# EAGLE design rk86fdd (EAGLE 6.4)

## Sheet 1 of 2
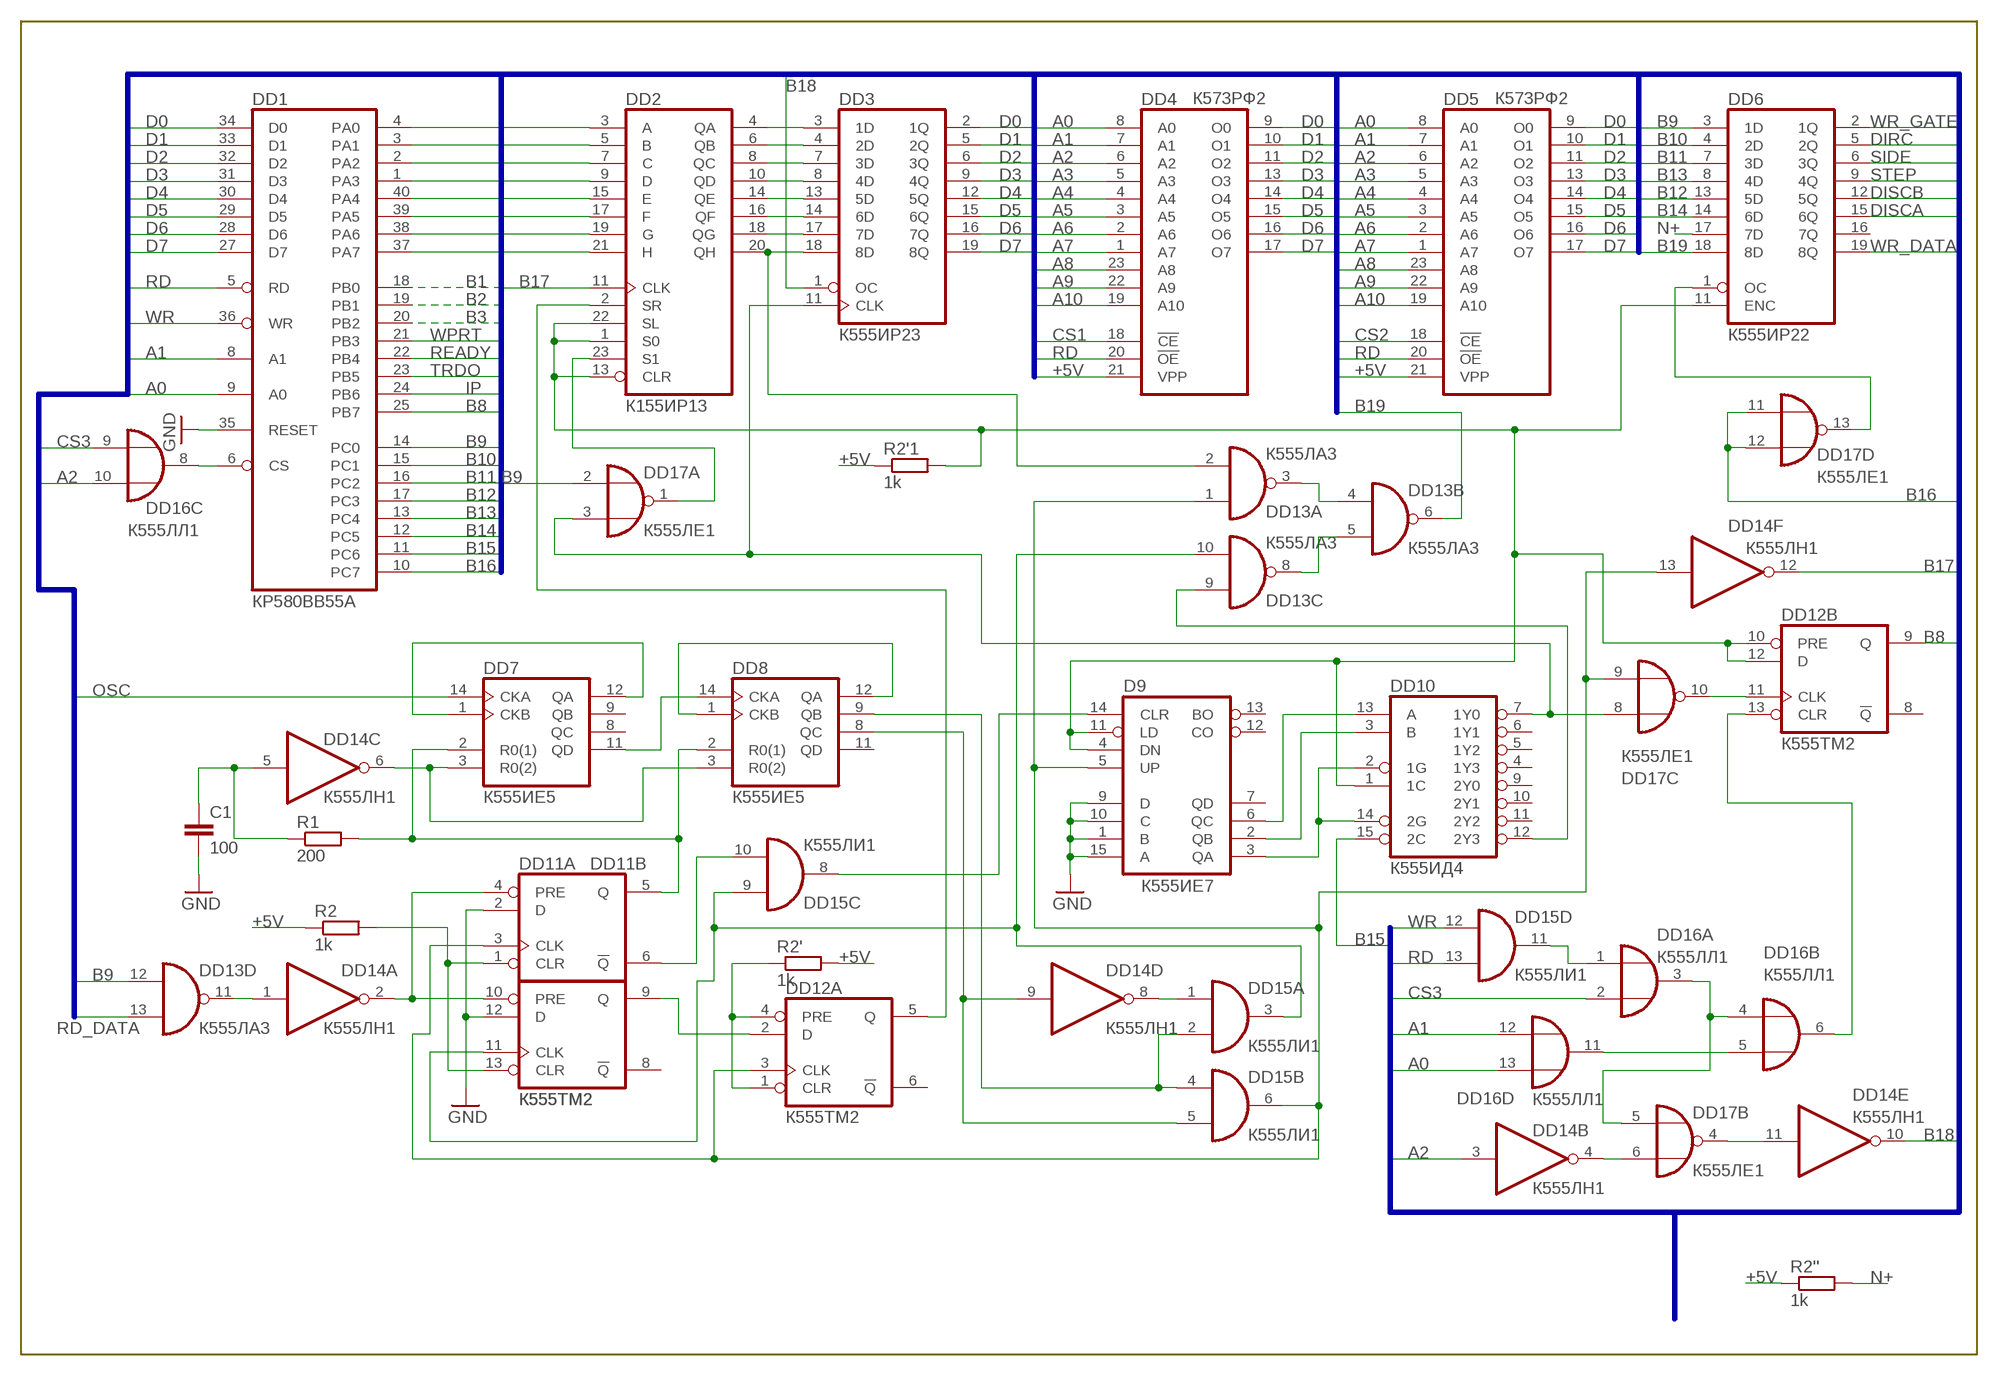
[diagram p0: schematic, sheet 1]

### Parts
C1  100  C-EU050-025X075  [C050-025X075]
D9  К555ИЕ7  74LS192N  [DIL16]
DD1  КР580ВВ55А  8255A  [DIL40]
DD2  К155ИР13  74198N  [DIL24-6]
DD3  К555ИР23  74LS374N  [DIL20]
DD4  К573РФ2  2716  [DIL24]
DD5  К573РФ2  2716  [DIL24]
DD6  К555ИР22  74LS373N  [DIL20]
DD7  К555ИЕ5  74HC93N  [DIL14]
DD8  К555ИЕ5  74HC93N  [DIL14]
DD10  К555ИД4  74LS155N  [DIL16]
DD11  К555ТМ2  74LS74N  [DIL14]
DD12  К555ТМ2  74LS74N  [DIL14]
DD13  К555ЛА3  74LS00N  [DIL14]
DD14  К555ЛН1  74LS04N  [DIL14]
DD15  К555ЛИ1  74LS08N  [DIL14]
DD16  К555ЛЛ1  74LS32N  [DIL14]
DD17  К555ЛЕ1  74LS02N  [DIL14]
R1  200  R-EU_R0805  [R0805]
R2  1k  R-EU_R0805  [R0805]
R2'  1k  R-EU_R0805  [R0805]
R2'1  1k  R-EU_R0805  [R0805]
R2''  1k  R-EU_R0805  [R0805]

### Nets
1LOG: D9.4(DN) D9.11(LD) DD2.1(S0) DD2.13(CLR) DD2.22(SL) DD6.11(ENC) DD10.1(1C) DD12.10(B:PRE) DD12.12(B:D) R2'1.2
+5V: DD4.21(VPP) DD5.21(VPP) R2'1.1 R2''.1 R2'.2 R2.1 ; also sheet 2
A0: DD1.9(A0) DD4.8(A0) DD5.8(A0) DD16.13(D:I1) ; also sheet 2
A1: DD1.8(A1) DD4.7(A1) DD5.7(A1) DD16.12(D:I0) ; also sheet 2
A2: DD4.6(A2) DD5.6(A2) DD14.3(B:I) DD16.10(C:I1) ; also sheet 2
A3: DD4.5(A3) DD5.5(A3) ; also sheet 2
A4: DD4.4(A4) DD5.4(A4) ; also sheet 2
A5: DD4.3(A5) DD5.3(A5) ; also sheet 2
A6: DD4.2(A6) DD5.2(A6) ; also sheet 2
A7: DD4.1(A7) DD5.1(A7) ; also sheet 2
A8: DD4.23(A8) DD5.23(A8) ; also sheet 2
A9: DD4.22(A9) DD5.22(A9) ; also sheet 2
A10: DD4.19(A10) DD5.19(A10) ; also sheet 2
B1: DD1.18(PB0)
B2: DD1.19(PB1)
B3: DD1.20(PB2)
B8: DD1.25(PB7) DD12.9(B:Q)
B9: DD1.14(PC0) DD6.3(1D) DD13.12(D:I0) DD17.2(A:I0)
B10: DD1.15(PC1) DD6.4(2D)
B11: DD1.16(PC2) DD6.7(3D)
B12: DD1.17(PC3) DD6.13(5D)
B13: DD1.13(PC4) DD6.8(4D)
B14: DD1.12(PC5) DD6.14(6D)
B15: DD1.11(PC6) DD10.15(2C)
B16: DD1.10(PC7) DD17.11(D:I0) DD17.12(D:I1)
B17: DD2.11(CLK) DD14.12(F:O)
B18: DD3.1(OC) DD14.10(E:O)
B19: DD6.18(8D) DD13.6(B:O)
CS1: DD4.18(!CE) ; also sheet 2
CS2: DD5.18(!CE) ; also sheet 2
CS3: DD16.2(A:I1) DD16.9(C:I0) ; also sheet 2
D0: DD1.34(D0) DD3.2(1Q) DD4.9(O0) DD5.9(O0) ; also sheet 2
D1: DD1.33(D1) DD3.5(2Q) DD4.10(O1) DD5.10(O1) ; also sheet 2
D2: DD1.32(D2) DD3.6(3Q) DD4.11(O2) DD5.11(O2) ; also sheet 2
D3: DD1.31(D3) DD3.9(4Q) DD4.13(O3) DD5.13(O3) ; also sheet 2
D4: DD1.30(D4) DD3.12(5Q) DD4.14(O4) DD5.14(O4) ; also sheet 2
D5: DD1.29(D5) DD3.15(6Q) DD4.15(O5) DD5.15(O5) ; also sheet 2
D6: DD1.28(D6) DD3.16(7Q) DD4.16(O6) DD5.16(O6) ; also sheet 2
D7: DD1.27(D7) DD3.19(8Q) DD4.17(O7) DD5.17(O7) ; also sheet 2
DD12Q5: DD2.2(SR) DD12.5(A:Q)
DIRC: DD6.5(2Q) ; also sheet 2
DISCA: DD6.15(6Q) ; also sheet 2
DISCB: DD6.12(5Q) ; also sheet 2
GND: C1.2 D9.1(B) D9.9(D) D9.10(C) D9.15(A) DD1.35(RESET) DD11.2(A:D) DD11.12(B:D) ; also sheet 2
IP: DD1.24(PB6) ; also sheet 2
LOG1: DD12.1(A:CLR) DD12.4(A:PRE) R2'.1
N$1: DD13.11(D:O) DD14.1(A:I)
N$2: DD2.4(QA) DD3.3(1D)
N$3: DD2.6(QB) DD3.4(2D)
N$4: DD2.8(QC) DD3.7(3D)
N$5: DD2.10(QD) DD3.8(4D)
N$6: DD2.14(QE) DD3.13(5D)
N$7: DD2.16(QF) DD3.14(6D)
N$8: DD2.18(QG) DD3.17(7D)
N$9: DD2.20(QH) DD3.18(8D) DD13.2(A:I1)
N$10: DD7.1(CKB) DD7.12(QA)
N$11: DD8.1(CKB) DD8.12(QA)
N$12: DD1.4(PA0) DD2.3(A)
N$13: DD1.3(PA1) DD2.5(B)
N$14: DD1.2(PA2) DD2.7(C)
N$15: DD1.1(PA3) DD2.9(D)
N$16: DD7.11(QD) DD8.14(CKA)
N$17: DD7.3(R0(2)) DD8.3(R0(2)) DD14.6(C:O)
N$18: DD1.40(PA4) DD2.15(E)
N$19: DD1.39(PA5) DD2.17(F)
N$20: DD1.38(PA6) DD2.19(G)
N$21: DD1.37(PA7) DD2.21(H)
N$22: DD7.2(R0(1)) DD8.2(R0(1)) DD11.5(A:Q) R1.2
N$23: D9.5(UP) DD11.3(A:CLK) DD12.3(A:CLK) DD13.1(A:I0) DD14.13(F:I) DD15.6(B:O) DD17.9(C:I1)
N$24: DD11.1(A:CLR) DD11.13(B:CLR) R2.2
N$25: DD11.9(B:Q) DD12.2(A:D)
N$26: DD15.11(D:O) DD16.1(A:I0)
N$27: DD6.1(OC) DD17.13(D:O)
N$28: C1.1 DD14.5(C:I) R1.1
N$29: DD2.23(S1) DD17.1(A:O)
N$30: DD3.11(CLK) DD10.7(1Y0) DD17.3(A:I1) DD17.8(C:I0)
N$31: DD11.4(A:PRE) DD11.10(B:PRE) DD14.2(A:O)
N$32: DD16.3(A:O) DD16.4(B:I0) DD17.5(B:I0)
N$33: DD1.6(CS) DD16.8(C:O)
N$34: D9.3(QA) DD10.2(1G) DD10.14(2G)
N$35: DD11.6(A:!Q) DD15.10(C:I1)
N$36: DD11.11(B:CLK) DD13.10(C:I1) DD15.3(A:O) DD15.9(C:I0)
N$37: DD12.11(B:CLK) DD17.10(C:O)
N$38: DD16.5(B:I1) DD16.11(D:O)
N$39: DD14.4(B:O) DD17.6(B:I1)
N$40: DD12.13(B:CLR) DD16.6(B:O)
N$41: DD14.11(E:I) DD17.4(B:O)
N$42: DD8.9(QB) DD15.2(A:I1) DD15.4(B:I0)
N$43: DD14.8(D:O) DD15.1(A:I0)
N$44: DD8.8(QC) DD14.9(D:I) DD15.5(B:I1)
N$45: DD13.3(A:O) DD13.4(B:I0)
N$46: DD13.5(B:I1) DD13.8(C:O)
N$48: D9.14(CLR) DD15.8(C:O)
N$49: D9.2(QB) DD10.3(B)
N$50: D9.6(QC) DD10.13(A)
N$51: DD10.12(2Y3) DD13.9(C:I0)
N+: DD6.17(7D) R2''.2
OSC: DD7.14(CKA) ; also sheet 2
RD: DD1.5(RD) DD4.20(!OE) DD5.20(!OE) DD15.13(D:I1) ; also sheet 2
RD_DATA: DD13.13(D:I1) ; also sheet 2
READY: DD1.22(PB4) ; also sheet 2
SIDE: DD6.6(3Q) ; also sheet 2
STEP: DD6.9(4Q) ; also sheet 2
TRDO: DD1.23(PB5) ; also sheet 2
WPRT: DD1.21(PB3) ; also sheet 2
WR: DD1.36(WR) DD15.12(D:I0) ; also sheet 2
WR_DATA: DD6.19(8Q) ; also sheet 2
WR_GATE: DD6.2(1Q) ; also sheet 2
Unconnected: D9.7(QD) D9.12(CO) D9.13(BO) DD6.16(7Q) DD7.8(QC) DD7.9(QB) DD8.11(QD) DD10.4(1Y3) DD10.5(1Y2) DD10.6(1Y1) DD10.9(2Y0) DD10.10(2Y1) DD10.11(2Y2) DD11.8(B:!Q) DD12.6(A:!Q) DD12.8(B:!Q)

### Buses
A[0..10],D[0..7],CS[1..3],WPRT,READY,TRDO,B[1..3],B[8..19],DD12Q5,+5V,WR_GATE,DIRC,SIDE,STEP,DISCB,DISCA,WR_DATA,IP,RD,WR,ER,OSC,RD_DATA

## Sheet 2 of 2
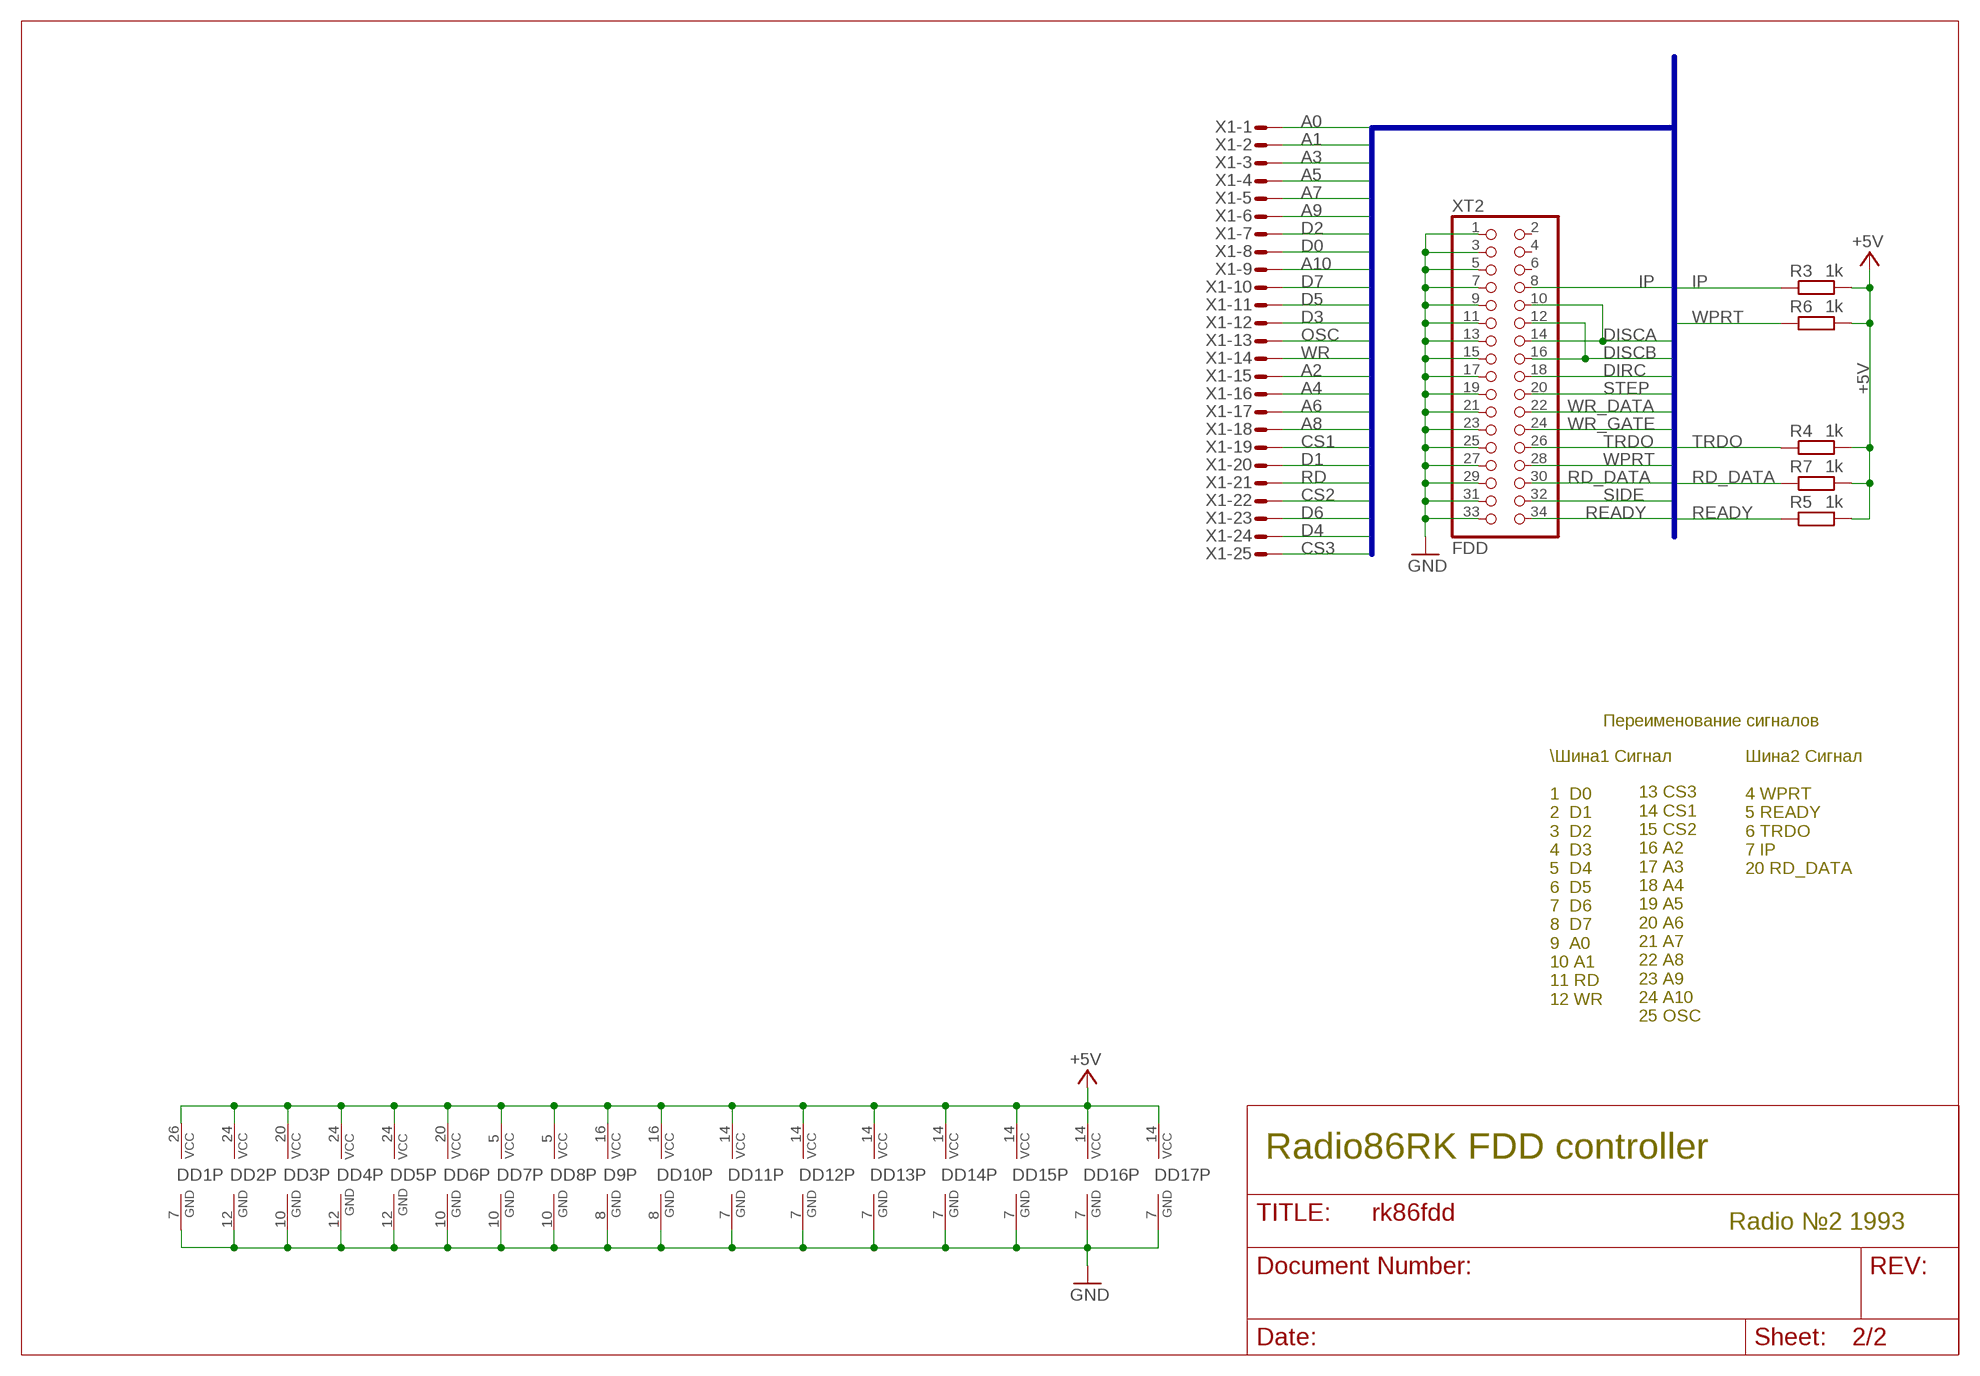
[diagram p1: schematic, sheet 2]

### Parts
R3  1k  R-EU_R0805  [R0805]
R4  1k  R-EU_R0805  [R0805]
R5  1k  R-EU_R0805  [R0805]
R6  1k  R-EU_R0805  [R0805]
R7  1k  R-EU_R0805  [R0805]
X1  M25HPS  [M25HP]
XT2  FDD  PINHD-2X17  [2X17]

### Nets
+5V: D9.16(VCC) DD1.26(VCC) DD2.24(VCC) DD3.20(VCC) DD4.24(VCC) DD5.24(VCC) DD6.20(VCC) DD7.5(VCC) DD8.5(VCC) DD10.16(VCC) DD11.14(P:VCC) DD12.14(P:VCC) DD13.14(P:VCC) DD14.14(P:VCC) DD15.14(P:VCC) DD16.14(P:VCC) DD17.14(P:VCC) R3.2 R4.2 R5.2 R6.2 R7.2 ; also sheet 1
A0: X1.1 ; also sheet 1
A1: X1.2 ; also sheet 1
A2: X1.15 ; also sheet 1
A3: X1.3 ; also sheet 1
A4: X1.16 ; also sheet 1
A5: X1.4 ; also sheet 1
A6: X1.17 ; also sheet 1
A7: X1.5 ; also sheet 1
A8: X1.18 ; also sheet 1
A9: X1.6 ; also sheet 1
A10: X1.9 ; also sheet 1
CS1: X1.19 ; also sheet 1
CS2: X1.22 ; also sheet 1
CS3: X1.25 ; also sheet 1
D0: X1.8 ; also sheet 1
D1: X1.20 ; also sheet 1
D2: X1.7 ; also sheet 1
D3: X1.12 ; also sheet 1
D4: X1.24 ; also sheet 1
D5: X1.11 ; also sheet 1
D6: X1.23 ; also sheet 1
D7: X1.10 ; also sheet 1
DIRC: XT2.18 ; also sheet 1
DISCA: XT2.10 XT2.14 ; also sheet 1
DISCB: XT2.12 XT2.16 ; also sheet 1
GND: D9.8(GND) DD1.7(GND) DD2.12(GND) DD3.10(GND) DD4.12(GND) DD5.12(GND) DD6.10(GND) DD7.10(GND) DD8.10(GND) DD10.8(GND) DD11.7(P:GND) DD12.7(P:GND) DD13.7(P:GND) DD14.7(P:GND) DD15.7(P:GND) DD16.7(P:GND) DD17.7(P:GND) XT2.1 XT2.3 XT2.5 XT2.7 XT2.9 XT2.11 XT2.13 XT2.15 XT2.17 XT2.19 XT2.21 XT2.23 XT2.25 XT2.27 XT2.29 XT2.31 XT2.33 ; also sheet 1
IP: R3.1 XT2.8 ; also sheet 1
OSC: X1.13 ; also sheet 1
RD: X1.21 ; also sheet 1
RD_DATA: R7.1 XT2.30 ; also sheet 1
READY: R5.1 XT2.34 ; also sheet 1
SIDE: XT2.32 ; also sheet 1
STEP: XT2.20 ; also sheet 1
TRDO: R4.1 XT2.26 ; also sheet 1
WPRT: R6.1 XT2.28 ; also sheet 1
WR: X1.14 ; also sheet 1
WR_DATA: XT2.22 ; also sheet 1
WR_GATE: XT2.24 ; also sheet 1
Unconnected: XT2.2 XT2.4 XT2.6

### Buses
A[0..10],D[0..7],CS[1..3],WPRT,READY,TRDO,B[1..3],B[8..19],DD12Q5,+5V,WR_GATE,DIRC,SIDE,STEP,DISCB,DISCA,WR_DATA,IP,RD,WR,ER,OSC,RD_DATA

### Notes on the sheet
- Переименование сигналов
- \Шина1 Сигнал
  
  1  D0
  2  D1
  3  D2
  4  D3
  5  D4
  6  D5
  7  D6
  8  D7
  9  A0
  10 A1
  11 RD
  12 WR
- Шина2 Сигнал
  
  4 WPRT
  5 READY
  6 TRDO
  7 IP
  20 RD_DATA
- 13 CS3
  14 CS1
  15 CS2
  16 A2
  17 A3
  18 A4
  19 A5
  20 A6
  21 A7
  22 A8
  23 A9
  24 A10
  25 OSC
- Radio86RK FDD controller
- Radio №2 1993

## Library data of the parts
C1 = rcl:C-EU: CAPACITOR, European symbol
D9 = 74xx-eu:74*192: Synchronous 4-bit UP/DOWN COUNTER
DD1 = micro-intel:8255A: MICROCOMPUTER/PERIPHERAL DEVICE; OC_FARNELL: unknown; OC_NEWARK: unknown
DD2 = 74xx-eu:74*198: 8-bit SHIFT REGISTER
DD3 = 74xx-eu:74*374: Octal D type transparent LATCH, edge triggered
DD4 DD5 = memory:2716: MEMORY
DD6 = 74xx-eu:74*373: Octal D type transparent LATCH, edge triggered
DD7 DD8 = 74xx-eu:74*93: Decade, divide by twelve and binary COUNTER
DD10 = 74xx-eu:74*155: Dual 2-line to 4-line data DECODER/DEMULTIPLEXER
DD11 DD12 = 74xx-eu:74*74: Dual D type positive edge triggered FLIP FLOP, preset and clear
DD13 = 74xx-eu:74*00: Quad 2-input NAND gate
DD14 = 74xx-eu:74*04: Hex INVERTER
DD15 = 74xx-eu:74*08: Quad 2-input AND gate
DD16 = 74xx-eu:74*32: Quad 2-input OR gate
DD17 = 74xx-eu:74*02: Quad 2-input NOR gate
R1 R2 R2' R2'1 R2'' R3-R7 = rcl:R-EU_: RESISTOR, European symbol
X1 = con-subd:M25?S: SUB-D; OC_FARNELL: unknown; OC_NEWARK: unknown
XT2 = Разъёмы штырьковые 2.54мм:PINHD-2X17: PIN HEADER

## Board
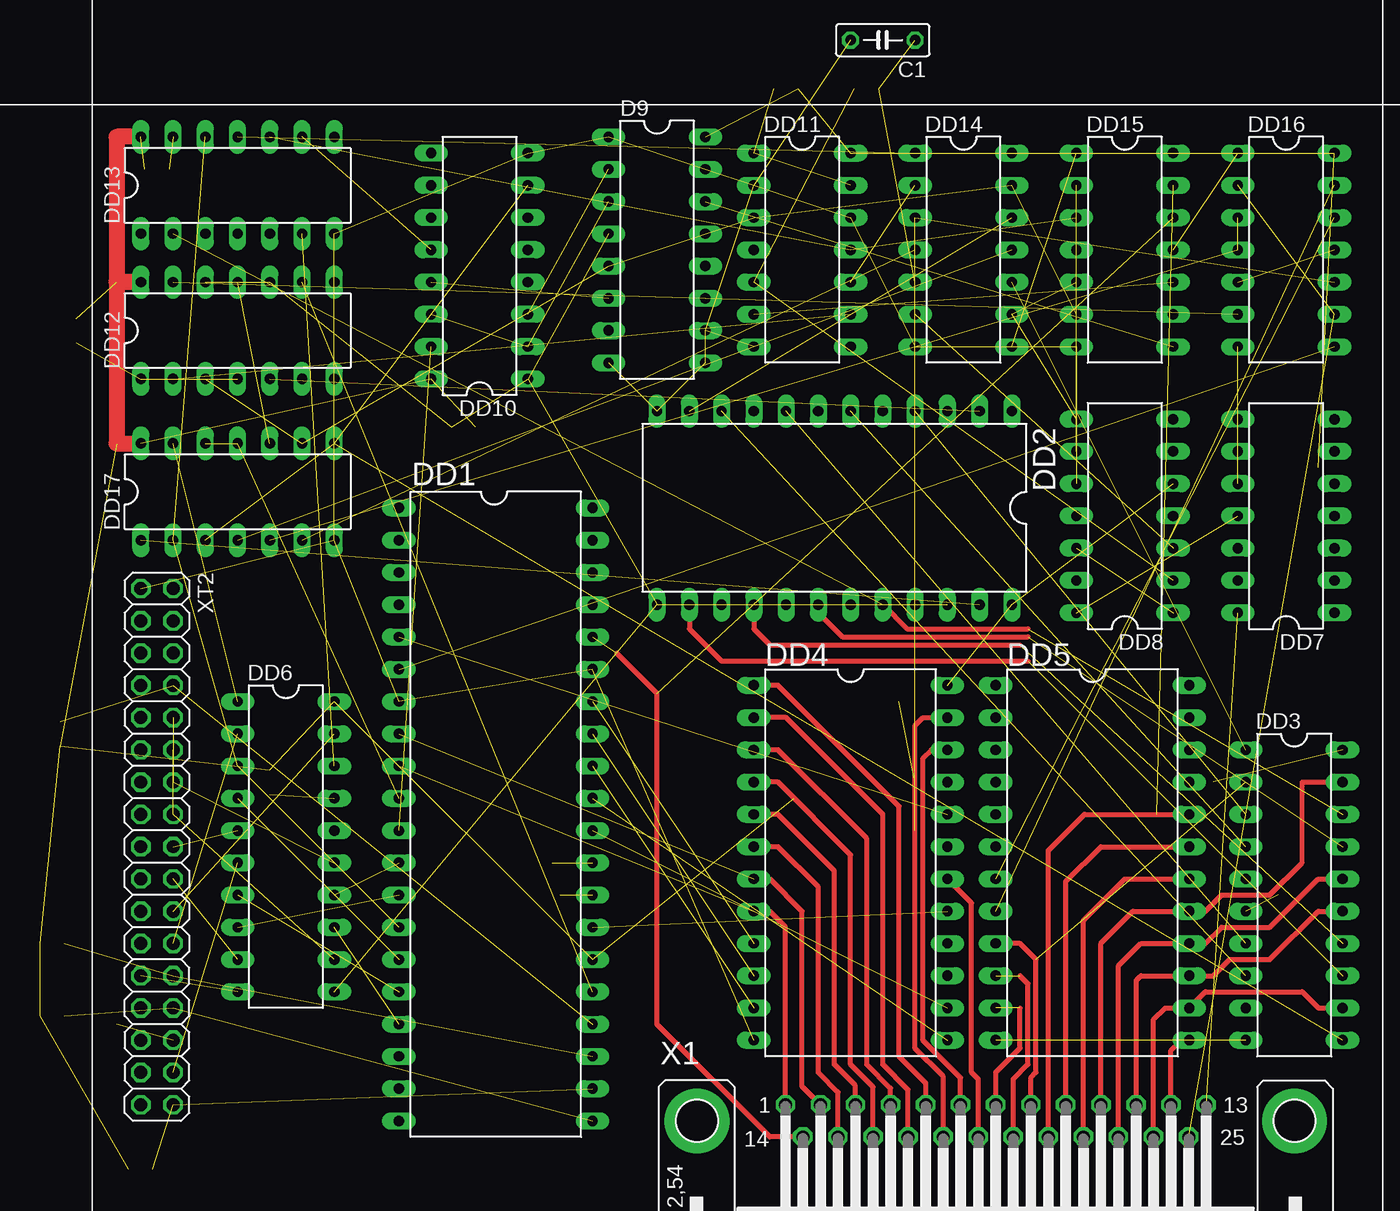
[diagram p2: board, top side]
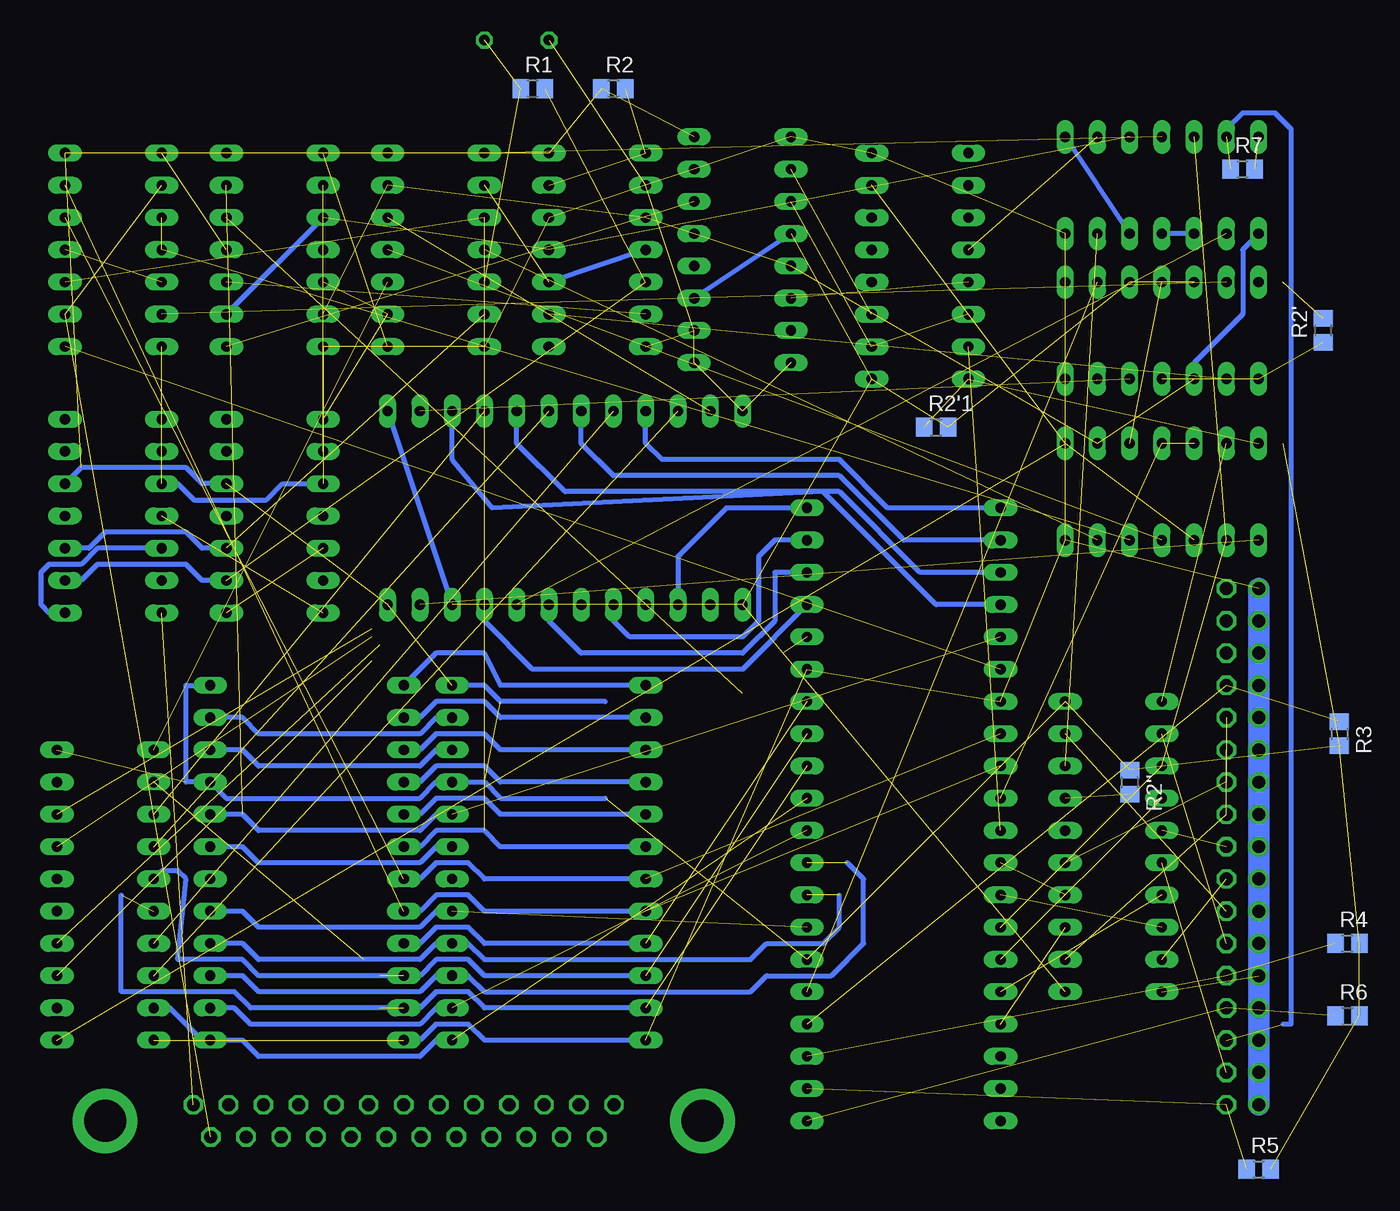
[diagram p3: board, bottom side, seen from below]

No outline drawn. Coordinates in mm, seen from the top.
Copper layers (1*16): Top 0.035mm / dielectric 1.5mm / Bottom 0.035mm
Design rules "default": minimum track width 10mil, minimum drill 24mil, track to track 8mil, track to pad 8mil, pad to pad 8mil, via to via 8mil, smd to smd 8mil, copper to edge 40mil, drill to drill 8mil, minimum pad ring 10mil, minimum via ring 8mil, stop-mask expansion 4mil, vias tented up to drill 0mil, thermal gap 10mil

### Footprints (pad centres in the part's own frame; a part is rotated, then mirrored left to right if it is on the bottom)
C050-025X075 = drill 0.813 octagon: 1 -2.54,0; 2 2.54,0
DIL16 = drill 0.813 long: 1 -8.89,-3.81; 2 -6.35,-3.81; 3 -3.81,-3.81; 4 -1.27,-3.81; 5 1.27,-3.81; 6 3.81,-3.81; 7 6.35,-3.81; 8 8.89,-3.81; 9 8.89,3.81; 10 6.35,3.81; 11 3.81,3.81; 12 1.27,3.81; 13 -1.27,3.81; 14 -3.81,3.81; 15 -6.35,3.81; 16 -8.89,3.81
DIL40 = drill 0.813 long: 1 -24.13,-7.62; 2 -21.59,-7.62; 3 -19.05,-7.62; 4 -16.51,-7.62; 5 -13.97,-7.62; 6 -11.43,-7.62; 7 -8.89,-7.62; 8 -6.35,-7.62; 9 -3.81,-7.62; 10 -1.27,-7.62; 11 1.27,-7.62; 12 3.81,-7.62; 13 6.35,-7.62; 14 8.89,-7.62; 15 11.43,-7.62; 16 13.97,-7.62; 17 16.51,-7.62; 18 19.05,-7.62; 19 21.59,-7.62; 20 24.13,-7.62; 21 24.13,7.62; 22 21.59,7.62; 23 19.05,7.62; 24 16.51,7.62; 25 13.97,7.62; 26 11.43,7.62; 27 8.89,7.62; 28 6.35,7.62; 29 3.81,7.62; 30 1.27,7.62; 31 -1.27,7.62; 32 -3.81,7.62; 33 -6.35,7.62; 34 -8.89,7.62; 35 -11.43,7.62; 36 -13.97,7.62; 37 -16.51,7.62; 38 -19.05,7.62; 39 -21.59,7.62; 40 -24.13,7.62
DIL24-6 = drill 0.813 long: 1 -13.97,-7.62; 2 -11.43,-7.62; 3 -8.89,-7.62; 4 -6.35,-7.62; 5 -3.81,-7.62; 6 -1.27,-7.62; 7 1.27,-7.62; 8 3.81,-7.62; 9 6.35,-7.62; 10 8.89,-7.62; 11 11.43,-7.62; 12 13.97,-7.62; 13 13.97,7.62; 14 11.43,7.62; 15 8.89,7.62; 16 6.35,7.62; 17 3.81,7.62; 18 1.27,7.62; 19 -1.27,7.62; 20 -3.81,7.62; 21 -6.35,7.62; 22 -8.89,7.62; 23 -11.43,7.62; 24 -13.97,7.62
DIL20 = drill 0.813 long: 1 -11.43,-3.81; 2 -8.89,-3.81; 3 -6.35,-3.81; 4 -3.81,-3.81; 5 -1.27,-3.81; 6 1.27,-3.81; 7 3.81,-3.81; 8 6.35,-3.81; 9 8.89,-3.81; 10 11.43,-3.81; 11 11.43,3.81; 12 8.89,3.81; 13 6.35,3.81; 14 3.81,3.81; 15 1.27,3.81; 16 -1.27,3.81; 17 -3.81,3.81; 18 -6.35,3.81; 19 -8.89,3.81; 20 -11.43,3.81
DIL24 = drill 0.813 long: 1 -13.97,-7.62; 2 -11.43,-7.62; 3 -8.89,-7.62; 4 -6.35,-7.62; 5 -3.81,-7.62; 6 -1.27,-7.62; 7 1.27,-7.62; 8 3.81,-7.62; 9 6.35,-7.62; 10 8.89,-7.62; 11 11.43,-7.62; 12 13.97,-7.62; 13 13.97,7.62; 14 11.43,7.62; 15 8.89,7.62; 16 6.35,7.62; 17 3.81,7.62; 18 1.27,7.62; 19 -1.27,7.62; 20 -3.81,7.62; 21 -6.35,7.62; 22 -8.89,7.62; 23 -11.43,7.62; 24 -13.97,7.62
DIL14 = drill 0.813 long: 1 -7.62,-3.81; 2 -5.08,-3.81; 3 -2.54,-3.81; 4 0,-3.81; 5 2.54,-3.81; 6 5.08,-3.81; 7 7.62,-3.81; 8 7.62,3.81; 9 5.08,3.81; 10 2.54,3.81; 11 0,3.81; 12 -2.54,3.81; 13 -5.08,3.81; 14 -7.62,3.81
R0805 = smd 1.3 x 1.5: 1 -0.95,0; 2 0.95,0
M25HP = drill 1.016 octagon: 1 -16.561,1.27; 2 -13.792,1.27; 3 -11.049,1.27; 4 -8.28,1.27; 5 -5.512,1.27; 6 -2.769,1.27; 7 0,1.27; 8 2.769,1.27; 9 5.512,1.27; 10 8.28,1.27; 11 11.049,1.27; 12 13.792,1.27; 13 16.561,1.27; 14 -15.189,-1.27; 15 -12.421,-1.27; 16 -9.652,-1.27; 17 -6.909,-1.27; 18 -4.14,-1.27; 19 -1.372,-1.27; 20 1.372,-1.27; 21 4.14,-1.27; 22 6.909,-1.27; 23 9.652,-1.27; 24 12.421,-1.27; 25 15.189,-1.27 | drill 3.302 pad 5.08: G1 -23.52,0; G2 23.52,0
2X17 = drill 1.016 octagon: 1 -20.32,-1.27; 2 -20.32,1.27; 3 -17.78,-1.27; 4 -17.78,1.27; 5 -15.24,-1.27; 6 -15.24,1.27; 7 -12.7,-1.27; 8 -12.7,1.27; 9 -10.16,-1.27; 10 -10.16,1.27; 11 -7.62,-1.27; 12 -7.62,1.27; 13 -5.08,-1.27; 14 -5.08,1.27; 15 -2.54,-1.27; 16 -2.54,1.27; 17 0,-1.27; 18 0,1.27; 19 2.54,-1.27; 20 2.54,1.27; 21 5.08,-1.27; 22 5.08,1.27; 23 7.62,-1.27; 24 7.62,1.27; 25 10.16,-1.27; 26 10.16,1.27; 27 12.7,-1.27; 28 12.7,1.27; 29 15.24,-1.27; 30 15.24,1.27; 31 17.78,-1.27; 32 17.78,1.27; 33 20.32,-1.27; 34 20.32,1.27

### Placement (x,y rotation side)
C1  92.71,96.52 180 top
D9  74.93,80.01 270 top
DD1  62.23,35.56 270 top
DD2  88.9,59.69 180 top
DD3  125.09,29.21 270 top
DD4  90.17,31.75 270 top
DD5  109.22,31.75 270 top
DD6  45.72,33.02 270 top
DD7  124.46,59.05 90 top
DD8  111.76,59.05 90 top
DD10  60.96,78.74 90 top
DD11  86.36,80.01 270 top
DD12  41.91,73.66 0 top
DD13  41.91,85.09 0 top
DD14  99.06,80.01 270 top
DD15  111.76,80.01 270 top
DD16  124.46,80.01 270 top
DD17  41.91,60.96 0 top
R1  91.44,92.71 0 bottom
R2  85.09,92.71 0 bottom
R2'  29.21,73.66 90 bottom
R2'1  59.69,66.04 0 bottom
R2''  44.45,38.1 270 bottom
R3  27.94,41.91 270 bottom
R4  27.3,25.4 0 bottom
R5  34.29,7.62 0 bottom
R6  27.3,19.68 0 bottom
R7  35.56,86.36 0 bottom
X1  101.6,11.43 0 top
XT2  35.56,33.02 270 top

### Tracks (layer width: path | path; a pad name or v marks a point on that pad's centre or on a via)
1LOG  (7 unrouted)
  Bottom 0.406: D9.4 D9.11 | DD2.1 DD2.22
+5V  (22 unrouted)
  Top 1.27: DD13.14 32.38,88.9 32.38,77.47 | 32.38,77.47 32.38,64.77 DD17.14 | DD12.14 32.38,77.47
  Bottom 0.406: 85.72,36.83 93.98,36.83 95.25,38.1 DD4.21 99.06,38.1 100.33,36.83 115.57,36.83 DD5.21 118.75,38.1 118.75,45.72 DD5.24 | 85.72,44.45 93.98,44.45 95.25,45.72 DD4.24 | DD8.5 117.47,61.59 118.75,62.87 127,62.87 DD7.5
A0  (2 unrouted)
  Top 0.406: X1.1 85.04,26.72 83.82,27.94 DD4.8
  Bottom 0.406: DD4.8 95.25,27.94 96.52,29.21 99.06,29.21 100.33,27.94 DD5.8
A1  (2 unrouted)
  Top 0.406: DD4.7 83.82,30.48 86.36,27.94 86.36,14.15 X1.2
  Bottom 0.406: DD4.7 95.25,30.48 96.52,31.75 99.06,31.75 100.33,30.48 DD5.7
A2  (2 unrouted)
  Top 0.406: X1.15 89.18,13.69 87.63,15.24 87.63,29.84 84.45,33.02 DD4.6
  Bottom 0.406: DD4.6 93.98,33.02 95.25,34.29 99.06,34.29 100.33,33.02 DD5.6
A3
  Top 0.406: X1.3 90.55,14.22 88.9,15.88 88.9,31.11 84.45,35.56 DD4.5
  Bottom 0.406: DD4.5 93.98,35.56 95.25,36.83 99.06,36.83 100.33,35.56 DD5.5
A4
  Top 0.406: X1.16 91.95,14.1 90.17,15.88 90.17,32.38 84.45,38.1 DD4.4
  Bottom 0.406: DD4.4 93.98,38.1 95.25,39.37 99.06,39.37 100.33,38.1 DD5.4
A5
  Top 0.406: X1.4 93.32,13.99 91.44,15.88 91.44,33.66 84.45,40.64 DD4.3
  Bottom 0.406: DD4.3 93.98,40.64 95.25,41.91 99.06,41.91 100.33,40.64 DD5.3
A6
  Top 0.406: X1.17 94.69,13.89 92.71,15.88 92.71,35.56 85.09,43.18 DD4.2
  Bottom 0.406: DD4.2 93.98,43.18 95.25,44.45 99.06,44.45 100.33,43.18 DD5.2
A7
  Top 0.406: X1.5 96.09,14.4 93.98,16.51 93.98,36.2 84.45,45.72 DD4.1
  Bottom 0.406: DD4.1 93.98,45.72 95.25,48.26 99.06,48.26 DD5.1
A8
  Top 0.406: X1.18 97.46,14.94 95.25,17.14 95.25,42.55 95.89,43.18 DD4.23
  Bottom 0.406: DD4.23 99.06,43.18 100.33,41.91 113.03,41.91 114.3,43.18 DD5.23
A9
  Top 0.406: X1.6 98.83,14.83 95.89,17.78 95.89,40.01 96.52,40.64 DD4.22
  Bottom 0.406: DD4.22 99.06,40.64 100.33,39.37 113.03,39.37 114.3,40.64 DD5.22
A10
  Top 0.406: X1.9 107.11,30.28 109.86,33.02 DD5.19
  Bottom 0.406: DD4.19 99.06,33.02 100.33,31.75 113.03,31.75 114.3,33.02 DD5.19
B8  (1 unrouted)
B9  (3 unrouted)
B10  (1 unrouted)
B11  (1 unrouted)
B12  (1 unrouted)
B13  (1 unrouted)
B14  (1 unrouted)
B15  (1 unrouted)
B16  (2 unrouted)
B17  (1 unrouted)
B18  (1 unrouted)
B19  (1 unrouted)
CS1
  Top 0.406: DD4.18 99.69,28.57 99.69,15.24 100.23,14.71 X1.19
CS2
  Top 0.406: X1.22 108.51,27.23 111.76,30.48 DD5.18
CS3  (2 unrouted)
D0  (2 unrouted)
  Top 0.406: DD5.9 103.5,25.4 104.78,24.13 104.78,15.24 104.37,14.83 X1.8
  Bottom 0.406: DD4.9 95.25,25.4 96.52,26.67 99.06,26.67 100.33,25.4 DD5.9
D1  (2 unrouted)
  Top 0.406: 103.5,22.86 104.14,22.23 104.14,15.88 102.97,14.71 X1.20
  Bottom 0.406: DD4.10 95.25,22.86 96.52,24.13 99.06,24.13 100.33,22.86 DD5.10 113.03,22.86 114.3,24.13 119.38,24.13 118.75,30.48 119.38,31.11 120.65,31.11 DD3.5
D2  (3 unrouted)
  Top 0.406: 103.5,20.32 103.5,17.14 101.6,15.24 X1.7
  Bottom 0.406: DD4.11 95.25,20.32 96.52,21.59 99.06,21.59 100.33,20.32 DD5.11 113.67,20.32 114.94,21.59 123.83,21.59 123.83,29.21
D3  (1 unrouted)
  Top 0.406: X1.12 115.39,16.97 116.2,17.78 DD5.13
  Bottom 0.406: DD4.13 99.06,17.78 100.33,16.51 113.03,16.51 114.3,17.78 DD5.13 117.47,17.78 120.02,20.32 DD3.9
D4  (1 unrouted)
  Top 0.406: X1.24 114.02,19.41 114.94,20.32 DD5.14 118.11,21.59 125.73,21.59 127,20.32 DD3.12
  Bottom 0.406: DD4.14 99.06,20.32 100.33,19.05 113.67,19.05 114.94,20.32 DD5.14
D5  (1 unrouted)
  Top 0.406: X1.11 112.65,22.48 113.03,22.86 DD5.15 118.75,22.86 120.02,24.13 123.19,24.13 127,27.94 DD3.15
  Bottom 0.406: DD5.15 114.3,22.86 113.03,21.59 100.33,21.59 99.06,22.86 DD4.15 96.52,22.86 95.25,21.59 74.3,21.59 73.03,22.86 67.94,22.86 65.41,25.4 65.41,30.48 66.67,31.75
D6  (1 unrouted)
  Top 0.406: X1.23 111.25,23.62 113.03,25.4 DD5.16 118.11,25.4 119.38,26.67 123.19,26.67 127,30.48 DD3.16
  Bottom 0.406: DD5.16 114.3,25.4 113.03,24.13 100.33,24.13 99.06,25.4 DD4.16 96.52,25.4 95.25,24.13 74.3,24.13 73.03,25.4 68.58,25.4 67.31,26.67 67.31,29.21
D7  (1 unrouted)
  Top 0.406: X1.10 109.88,25.43 112.39,27.94 DD5.17 118.11,27.94 119.38,29.21 123.19,29.21 125.73,31.75 125.73,38.1 DD3.19
  Bottom 0.406: DD4.17 99.06,27.94 100.33,26.67 113.03,26.67 114.3,27.94 DD5.17
DD12Q5  (1 unrouted)
DIRC  (1 unrouted)
DISCA  (2 unrouted)
DISCB  (2 unrouted)
GND  (23 unrouted)
  Bottom 0.406: DD4.12 95.25,17.78 96.52,19.05 99.06,19.05 100.33,17.78 DD5.12 | DD7.10 119.38,61.59 118.11,60.33 112.39,60.33 111.12,61.59 DD8.10
  Bottom 1.676: XT2.1 XT2.3 XT2.5 XT2.7 XT2.9 XT2.11 XT2.13 XT2.15 XT2.17 XT2.19 XT2.21 XT2.23 XT2.25 XT2.27 XT2.29 XT2.31 XT2.33
IP  (2 unrouted)
LOG1  (2 unrouted)
N$1  (1 unrouted)
N$2  (1 unrouted)
N$3  (1 unrouted)
N$4  (1 unrouted)
N$5  (1 unrouted)
N$6  (1 unrouted)
  Top 0.406: DD2.14 77.47,50.16 80.01,47.62 104.14,47.62
N$7  (1 unrouted)
  Top 0.406: DD2.16 82.55,50.16 83.82,48.9 103.5,48.9
N$8  (1 unrouted)
  Top 0.406: DD2.18 87.63,51.44 89.53,49.53 104.14,49.53
N$9  (2 unrouted)
  Top 0.406: DD2.20 94.61,50.16 104.14,50.16
N$10
  Bottom 0.406: DD7.12 125.73,56.52 127,55.24 129.54,55.24 130.18,54.61 130.18,52.07 129.54,51.44 DD7.1
N$11  (1 unrouted)
N$12
  Bottom 0.406: DD1.4 59.69,52.07 68.58,60.96 94.61,59.69 97.79,63.5 DD2.3
N$13
  Bottom 0.406: DD1.3 60.96,54.61 67.31,60.96 88.9,60.96 92.71,64.77 DD2.5
N$14
  Bottom 0.406: DD1.2 62.23,57.15 67.31,62.23 85.09,62.23 87.63,64.77 DD2.7
N$15
  Bottom 0.406: DD1.1 63.5,59.69 67.31,63.5 81.28,63.5 82.55,64.77 DD2.9
N$16  (1 unrouted)
N$17  (1 unrouted)
  Bottom 0.406: DD8.3 117.47,56.52 118.75,57.78 125.09,57.78 126.36,56.52 DD7.3
N$18
  Bottom 0.406: DD1.40 76.2,59.69 80.01,55.88 DD2.15
N$19
  Bottom 0.406: DD1.39 72.39,57.15 73.66,55.88 73.66,50.8 74.93,49.53 83.82,49.53 85.09,50.8 DD2.17
N$20
  Bottom 0.406: DD1.38 72.39,54.61 72.39,50.8 74.93,48.26 87.63,48.26 90.17,50.8 DD2.19
N$21
  Bottom 0.406: DD1.37 74.93,46.99 91.44,46.99 95.25,50.8 DD2.21
N$22  (2 unrouted)
  Bottom 0.406: DD8.2 117.47,53.98 118.75,55.24 125.73,55.24 127,53.98 DD7.2
N$23  (5 unrouted)
  Bottom 0.406: DD13.1 35.56,80.01 35.56,74.93 39.37,71.12 DD12.3
N$24  (2 unrouted)
N$25  (1 unrouted)
N$26  (1 unrouted)
N$27  (1 unrouted)
N$28  (2 unrouted)
N$29  (1 unrouted)
N$30  (3 unrouted)
N$31  (1 unrouted)
  Bottom 0.406: DD11.4 DD11.10
N$32  (2 unrouted)
N$33  (1 unrouted)
N$34  (2 unrouted)
N$35  (1 unrouted)
N$36  (2 unrouted)
  Bottom 0.406: DD15.3 DD15.9
N$37  (1 unrouted)
N$38  (1 unrouted)
N$39  (1 unrouted)
N$40  (1 unrouted)
N$41  (1 unrouted)
N$42  (2 unrouted)
N$43  (1 unrouted)
N$44  (2 unrouted)
N$45
  Bottom 0.406: DD13.3 DD13.4
N$46
  Bottom 0.406: DD13.5 DD13.8
N$48  (1 unrouted)
N$49  (1 unrouted)
N$50  (1 unrouted)
N$51  (1 unrouted)
N+  (1 unrouted)
OSC  (1 unrouted)
RD  (2 unrouted)
  Top 0.406: X1.21 105.74,32.72 108.58,35.56 DD5.20
  Bottom 0.406: DD4.20 99.06,35.56 100.33,34.29 113.03,34.29 114.3,35.56 DD5.20
RD_DATA  (2 unrouted)
  Bottom 0.406: DD13.13 36.83,89.53 35.56,90.81 33.02,90.81 31.75,89.53 31.75,19.05 32.38,19.05
READY  (2 unrouted)
SIDE  (1 unrouted)
STEP  (1 unrouted)
TRDO  (2 unrouted)
WPRT  (2 unrouted)
WR  (2 unrouted)
  Top 0.406: X1.14 83.82,10.16 74.93,19.05 74.93,45.09 71.75,48.26
WR_DATA  (1 unrouted)
WR_GATE  (1 unrouted)

### Text on the board
tPlace: 153x124 | 107x83 | <-- 106.6mm max --> | fdd 101x145